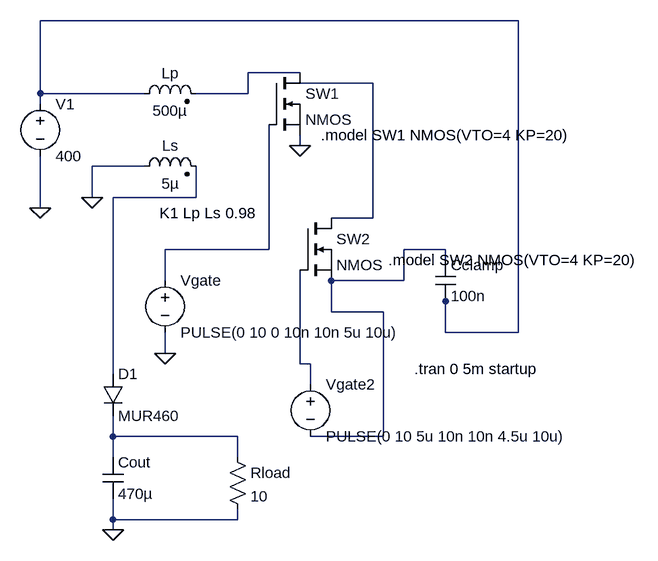
[diagram p0: schematic FLYBACK.asc]
FLYBACK.asc, the LTspice schematic file:
Version 4
SHEET 1 1196 804
WIRE 992 0 256 0
WIRE 656 80 576 80
WIRE 768 96 656 96
WIRE 256 112 256 0
WIRE 416 112 256 112
WIRE 576 112 576 80
WIRE 576 112 496 112
WIRE 256 128 256 112
WIRE 656 192 656 176
WIRE 416 224 336 224
WIRE 336 272 336 224
WIRE 496 272 496 224
WIRE 496 272 368 272
WIRE 256 288 256 208
WIRE 768 304 768 96
WIRE 768 304 704 304
WIRE 608 352 608 160
WIRE 608 352 448 352
WIRE 880 352 816 352
WIRE 880 368 880 352
WIRE 448 400 448 352
WIRE 816 400 816 352
WIRE 816 400 704 400
WIRE 880 432 880 416
WIRE 704 448 704 400
WIRE 784 448 704 448
WIRE 880 480 880 432
WIRE 992 480 992 0
WIRE 992 480 880 480
WIRE 448 512 448 480
WIRE 656 528 656 384
WIRE 672 528 656 528
WIRE 368 544 368 272
WIRE 672 560 672 528
WIRE 368 640 368 608
WIRE 560 640 368 640
WIRE 784 640 784 448
WIRE 784 640 672 640
WIRE 368 672 368 640
WIRE 560 672 560 640
WIRE 368 768 368 736
WIRE 560 768 560 752
WIRE 560 768 368 768
WIRE 368 784 368 768
FLAG 256 288 0
FLAG 656 192 0
FLAG 368 784 0
FLAG 448 512 0
FLAG 336 272 0
SYMBOL voltage 256 112 R0
WINDOW 123 0 0 Left 0
WINDOW 39 0 0 Left 0
SYMATTR InstName V1
SYMATTR Value 400
SYMBOL ind2 400 128 R270
WINDOW 0 32 56 VTop 2
WINDOW 3 5 56 VBottom 2
SYMATTR InstName Lp
SYMATTR Value 500µ
SYMATTR Type ind
SYMBOL ind2 400 240 R270
WINDOW 0 32 56 VTop 2
WINDOW 3 5 56 VBottom 2
SYMATTR InstName Ls
SYMATTR Value 5µ
SYMATTR Type ind
SYMBOL nmos 608 80 R0
SYMATTR InstName SW1
SYMBOL nmos 656 304 R0
SYMATTR InstName SW2
SYMBOL voltage 448 384 R0
WINDOW 123 0 0 Left 0
WINDOW 39 0 0 Left 0
SYMATTR InstName Vgate
SYMATTR Value PULSE(0 10 0 10n 10n 5u 10u)
SYMBOL cap 864 368 R0
SYMATTR InstName Cclamp
SYMATTR Value 100n
SYMBOL voltage 672 544 R0
WINDOW 123 0 0 Left 0
WINDOW 39 0 0 Left 0
SYMATTR InstName Vgate2
SYMATTR Value PULSE(0 10 5u 10n 10n 4.5u 10u)
SYMBOL diode 352 544 R0
SYMATTR InstName D1
SYMATTR Value MUR460
SYMBOL cap 352 672 R0
SYMATTR InstName Cout
SYMATTR Value 470µ
SYMATTR SpiceLine V=50
SYMBOL res 544 656 R0
SYMATTR InstName Rload
SYMATTR Value 10
TEXT 440 296 Left 2 !K1 Lp Ls 0.98
TEXT 832 536 Left 2 !.tran 0 5m startup
TEXT 688 176 Left 2 !.model SW1 NMOS(VTO=4 KP=20)
TEXT 792 368 Left 2 !.model SW2 NMOS(VTO=4 KP=20)

The netlist it stands for:
* FLYBACK.asc
V1 N001 0 400
Lp N001 N002 500µ
Ls 0 N004 5µ
M§SW1 N002 N005 0 0 NMOS
M§SW2 N003 N007 N006 N006 NMOS
Vgate N005 0 PULSE(0 10 0 10n 10n 5u 10u)
Cclamp N006 N001 100n
Vgate2 N007 N006 PULSE(0 10 5u 10n 10n 4.5u 10u)
D1 N004 N008 MUR460
Cout N008 0 470µ V=50
Rload N008 0 10
.model D D
.lib standard.dio
.model NMOS NMOS
.model PMOS PMOS
.lib standard.mos
K1 Lp Ls 0.98
.tran 0 5m startup
.model SW1 NMOS(VTO=4 KP=20)
.model SW2 NMOS(VTO=4 KP=20)
.backanno
.end